# Altium schematic sheet ToneController.SchDoc
size A4; SheetNumber: 4; SheetTotal: 5
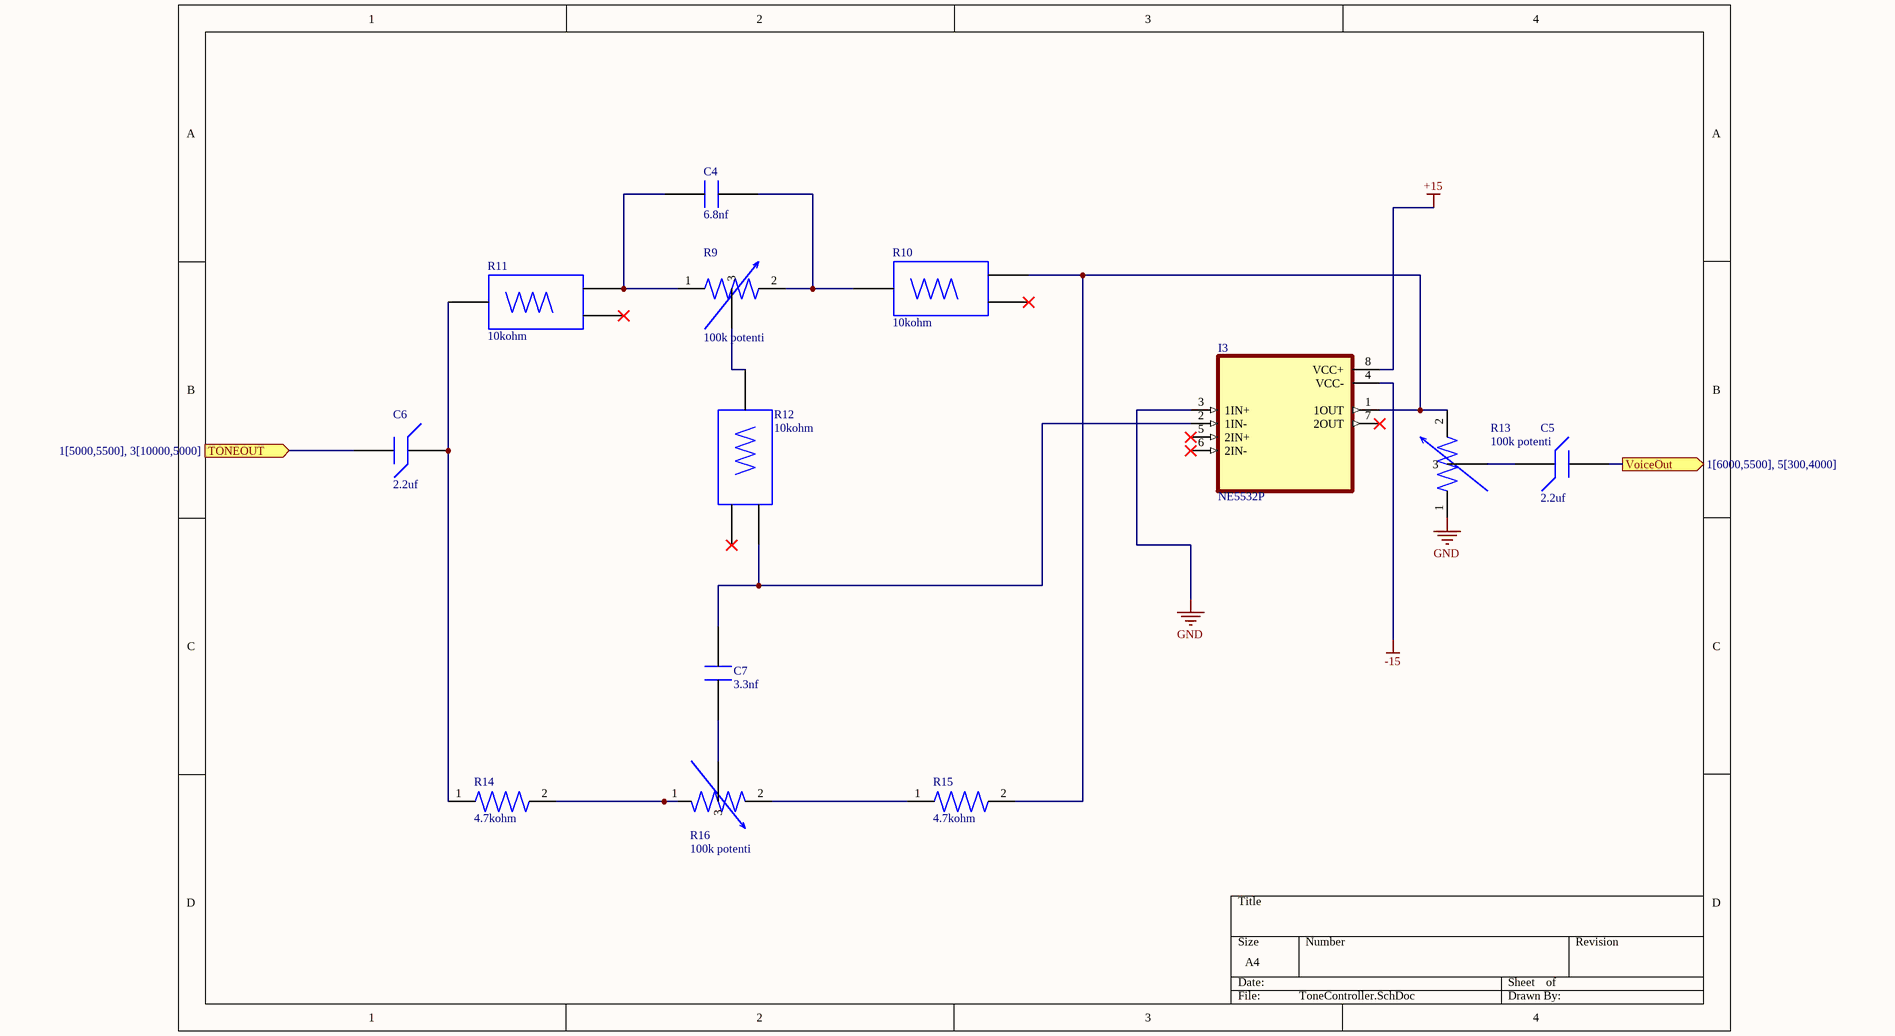
[diagram p0: ToneController.SchDoc]

## Parts
C4  6.8nf  [ceramic Capacitor]
C5  2.2uf  [Capasitor]
C6  2.2uf  [Capasitor]
C7  3.3nf  [ceramic Capacitor]
I3  NE5532P  [NE5532P]
R9  100k potenti  [Potentiometer - duplicate]
R10  10kohm  [10Kohm]
R11  10kohm  [10Kohm]
R12  10kohm  [10Kohm]
R13  100k potenti  [Potentiometer - duplicate]
R14  4.7kohm  [Resistor]
R15  4.7kohm  [Resistor]
R16  100k potenti  [Potentiometer - duplicate]

## Ports
TONEOUT (in, see 1[5000,5500], 3[10000,5000]), VoiceOut (out, see 1[6000,5500], 5[300,4000])

## Nets
+15: I3.8(VCC+)
-15: I3.4(VCC-)
GND: I3.3(1IN+) R13.1
TONEOUT: C6.1 ; port TONEOUT
VoiceOut: C5.1 ; port VoiceOut
NetC4_1: C4.1 R9.1 R11.2
NetC4_2: C4.2 R9.2 R10.1
NetC5_2: C5.2 R13.3
NetC6_2: C6.2 R11.1 R14.1
NetC7_1: C7.1 R16.3
NetC7_2: C7.2 I3.2(1IN-) R12.2
NetI3_1: I3.1(1OUT) R10.2 R13.2 R15.2
NetR9_3: R9.3 R12.1
NetR14_2: R14.2 R16.1
NetR15_1: R15.1 R16.2

Not connected (* = marked no-connect by the designer): I3 5(2IN+)* 6(2IN-)* 7(2OUT)*; R10 3*; R11 3*; R12 3*

## Library data of the parts
C4 = C781U682MZVDAAWL25: C700KJY SFTY X1-440 Y2-300, Ceramic, 6800 pF, 20%, 440 VAC (X1), 300 VAC (Y2), Y5V, Lead Spacing = 10mm; Manufacturer: KEMET; Supplier: Mouser; Supplier Part Number: 80-C781U682MZVDAWL25; Manufacturer Part Number: C781U682MZVDAAWL25; Stock: 168; Pricing: 1=2.61, 10=2.11, 50=2.11, 100=1.96, 1000=1.34, 10000=1.29 (USD); ComponentLink1URL: https://datasheet.octopart.com/C781U682MZVDAAWL25-KEMET-datasheet-181955793.pdf?src-supplier=Farnell; ComponentLink1Description: https://datasheet.octopart.com/C781U682MZVDAAWL25-KEMET-datasheet-181955793.pdf?src-supplier=Farnell
C5 C6 = 400LLE2R2MEFC8X11.5: Aluminum Electrolytic Capacitor, Polarized, Aluminum (wet), 400V, 20% +Tol, 20% -Tol, 2.2uF, Through Hole Mount; Manufacturer: Rubycon; Supplier: Digikey; Supplier Part Number: 1189-1329-ND; Manufacturer Part Number: 400LLE2R2MEFC8X11.5; RoHS: Yes; Category: Aluminum Electrolytic Capacitors; Stock: 36469; Pricing: 1=0.53, 10=0.326, 50=0.2416, 100=0.2148, 500=0.16848, 2000=0.14171, 4000=0.1316, 6000=0.1265 (USD); ComponentLink1URL: https://datasheet.ciiva.com:443/pdfs/VipMasterIC/IC/RUBY/RUBYS01654/RUBYS01654-1.pdf?src-supplier=IHS+Markit; ComponentLink1Description: https://datasheet.ciiva.com:443/pdfs/VipMasterIC/IC/RUBY/RUBYS01654/RUBYS01654-1.pdf?src-supplier=IHS+Markit; ComponentLink2URL: https://datasheet.ciiva.com/29544/e-lle-29544381.pdf?src-supplier=Digikey; ComponentLink2Description: https://datasheet.ciiva.com/29544/e-lle-29544381.pdf?src-supplier=Digikey
C7 = C731U332MZVDBA7317: Manufacturer: KEMET; Supplier: Digikey; Supplier Part Number: 399-C731U332MZVDBA7317CT-ND; Manufacturer Part Number: C731U332MZVDBA7317; RoHS: No; Stock: 4998; Pricing: 1=1.17, 10=0.757, 100=0.5449 (USD)
I3 = NE5532P: Operational Amplifier, 2 Func, 5000uV Offset-Max, BIPolar, PDIP8; Manufacturer: Texas Instruments; Package Body Material: Plastic; Architecture: VOLTAGE-FEEDBACK; Average Bias Current-Max (IIB): 1uA; Bias Current-Max (IIB) @25C: 800nA; Common-mode Reject Ratio-Nom: 100dB; Frequency Compensation: YES; Input Offset Voltage-Max: 5mV; Low-Offset: No; Neg Supply Voltage Limit-Max: -22V; Neg Supply Voltage-Nom (Vsup): -15V; Channels: 2; Package Equivalence Code: DIP8,.3; Power Supplies: +-5/+-15/10/30V; Slew Rate: 9V/µs; Max Supply Current: 16mA; Supply Voltage Limit-Max: 22V; Nominal Supply Voltage: 15V; Surface Mount: No; Unity Gain BW-Nom: 10MHz; Voltage Gain-Min: 10000; Common Mode Rejection Ratio-Min: 70dB; Qualification Status: Not Qualified; Supplier: Mouser; Supplier Part Number: 595-NE5532P; Manufacturer Part Number: NE5532P; RoHS: Yes; Category: Amplifiers - Op Amps, Buffer, Instrumentation; Stock: 14297; Pricing: 1=0.57, 10=0.402, 50=0.335, 100=0.313, 1000=0.266, 10000=0.254 (USD); Case/Package: DIP; Pins: 8; Package Shape: Rectangular; Terminal Finish: Tin; Min Operating Temperature: 0°C; Max Operating Temperature: 70°C; JESD-609 Code: e3; Amplifier Type: OPERATIONAL AMPLIFIER; JESD-30 Code: R-PDIP-T8; Package Style: IN-LINEMeter; Packaging: Rail/Tube; Technology: BIPOLAR; Terminal Form: Through Hole; Terminal Position: DUAL; Length: 9.81mm; Width: 7.62mm; Height - Seated (Max): 5.08mm; Terminal Pitch: 2.54mm; Temperature Grade: COMMERCIAL; Reach SVHC Compliant: Yes; RoHS Compliant: Yes; ComponentLink1URL: https://www.ti.com:443/lit/ds/symlink/ne5532.pdf?src-supplier=IHS+Markit; ComponentLink1Description: https://www.ti.com:443/lit/ds/symlink/ne5532.pdf?src-supplier=IHS+Markit; ComponentLink2URL: https://datasheet.ciiva.com/14151/jyne5532-e-14151126.pdf?src-supplier=Distrelec; ComponentLink2Description: https://datasheet.ciiva.com/14151/jyne5532-e-14151126.pdf?src-supplier=Distrelec; ComponentLink3URL: https://datasheet.ciiva.com/27050/903963-27050795.pdf?src-supplier=Jameco; ComponentLink3Description: https://datasheet.ciiva.com/27050/903963-27050795.pdf?src-supplier=Jameco; ComponentLink4URL: https://datasheet.ciiva.com/15129/getdatasheetpartid-41254-15129711.pdf?src-supplier=Verical; ComponentLink4Description: https://datasheet.ciiva.com/15129/getdatasheetpartid-41254-15129711.pdf?src-supplier=Verical; ComponentLink5URL: https://datasheet.ciiva.com/26325/151768-da-01-en-ne-5532p-26325914.pdf?src-supplier=Conrad; ComponentLink5Description: https://datasheet.ciiva.com/26325/151768-da-01-en-ne-5532p-26325914.pdf?src-supplier=Conrad; ComponentLink6URL: https://datasheet.ciiva.com/1803/ne5532-1803186.pdf?src-supplier=Digikey; ComponentLink6Description: https://datasheet.ciiva.com/1803/ne5532-1803186.pdf?src-supplier=Digikey; ComponentLink7URL: https://datasheet.ciiva.com/2973/sa5532a-2973704.pdf?src-supplier=Avnet; ComponentLink7Description: https://datasheet.ciiva.com/2973/sa5532a-2973704.pdf?src-supplier=Avnet
R9 R13 R16 = PDB12-H4251-104BF: Potentiometer, Carbon, 0.08W, 100000ohm, 150V, 20% +/-Tol; Manufacturer: Bourns; Power: 80mW; Value: 100kR; Rotational Angle: 300°; Package Length: 8.7mm; Supplier: Digikey; Supplier Part Number: PDB12-H4251-104BF-ND; Manufacturer Part Number: PDB12-H4251-104BF; RoHS: Yes; Category: Variable Resistors and Potentiometers; Stock: 619; Pricing: 1=1.11, 10=0.937, 25=0.8744, 50=0.83, 100=0.7875, 300=0.72413, 500=0.6963, 1000=0.66014, 2500=0.61504 (USD); Terminal Finish: Tin; Tolerance: 20%; JESD-609 Code: e3; Resistor Type: Potentiometer; Construction: Rotary; Technology: CARBON; Working Voltage: 150V; Reach SVHC Compliant: Yes; RoHS Compliant: Yes; ComponentLink1URL: https://datasheet.ciiva.com:443/pdfs/VipMasterIC/IC/BOUR/BOUR-S-A0002520119/BOUR-S-A0002520119-1.pdf?src-supplier=IHS+Markit; ComponentLink1Description: https://datasheet.ciiva.com:443/pdfs/VipMasterIC/IC/BOUR/BOUR-S-A0002520119/BOUR-S-A0002520119-1.pdf?src-supplier=IHS+Markit; ComponentLink2URL: https://datasheet.ciiva.com/4992/pdb12-27502-4992016.pdf?src-supplier=Mouser; ComponentLink2Description: https://datasheet.ciiva.com/4992/pdb12-27502-4992016.pdf?src-supplier=Mouser; ComponentLink3URL: https://datasheet.ciiva.com/6249/pdb12-6249578.pdf?src-supplier=Digikey; ComponentLink3Description: https://datasheet.ciiva.com/6249/pdb12-6249578.pdf?src-supplier=Digikey; ComponentLink4URL: https://datasheet.ciiva.com/8700/pdb12-8700988.pdf?src-supplier=Avnet; ComponentLink4Description: https://datasheet.ciiva.com/8700/pdb12-8700988.pdf?src-supplier=Avnet
R10-R12 = PFS35-10KF1: RES SMD 10K OHM 1% 35W TO263; Manufacturer: Riedon; Supplier: Digikey; Supplier Part Number: 696-1275-1-ND; Manufacturer Part Number: PFS35-10KF1; RoHS: Yes; Category: Chip SMD Resistors; Stock: 1068; Pricing: 1=4.84, 10=4.01, 50=3.536, 100=3.362 (USD); ComponentLink1URL: https://datasheet.ciiva.com/18597/pfs35-18597797.pdf?src-supplier=Digikey; ComponentLink1Description: https://datasheet.ciiva.com/18597/pfs35-18597797.pdf?src-supplier=Digikey
R14 R15 = CF18JT4K70: Fixed Resistor, Carbon Film, 0.125W, 4700ohm, 250V, 5% +/-Tol, -400,0ppm/Cel, Through Hole Mount; Manufacturer: Stackpole Electronics; Power: 125mW; Rated Temperature: 70°C; Value: 4.7kR; Temperature Coefficient (ppm/Cel): 400; Lead Diameter: 0.4mm; Lead Length: 28mm; Package Length: 3.3mm; Supplier: Digikey; Supplier Part Number: CF18JT4K70CT-ND; Manufacturer Part Number: CF18JT4K70; RoHS: Yes; Category: Through-Hole Resistors; Stock: 179076; Pricing: 1=0.1, 10=0.022, 25=0.0188, 50=0.0162, 100=0.0143, 250=0.01204, 500=0.01062, 1000=0.00943 (USD); Mounting Technology: Through Hole; Pins: 2; Package Shape: Tubular; Terminal Finish: Tin; Min Operating Temperature: -55°C; Max Operating Temperature: 155°C; Tolerance: 5%; JESD-609 Code: e3; Resistor Type: FIXED RESISTOR; Construction: Tubular; Package Style: AXIAL; Packaging: Tape and Reel; Technology: CARBON FILM; Termination: Wire; Working Voltage: 250V; Reach SVHC Compliant: Yes; RoHS Compliant: Yes; ComponentLink1URL: https://datasheet.ciiva.com:443/pdfs/VipMasterIC/IC/SEIE/SEIE-S-A0009883960/SEIE-S-A0009883960-1.pdf?src-supplier=IHS+Markit; ComponentLink1Description: https://datasheet.ciiva.com:443/pdfs/VipMasterIC/IC/SEIE/SEIE-S-A0009883960/SEIE-S-A0009883960-1.pdf?src-supplier=IHS+Markit; ComponentLink2URL: https://datasheet.ciiva.com/15193/getdatasheetpartid-408268-15193341.pdf?src-supplier=Verical; ComponentLink2Description: https://datasheet.ciiva.com/15193/getdatasheetpartid-408268-15193341.pdf?src-supplier=Verical